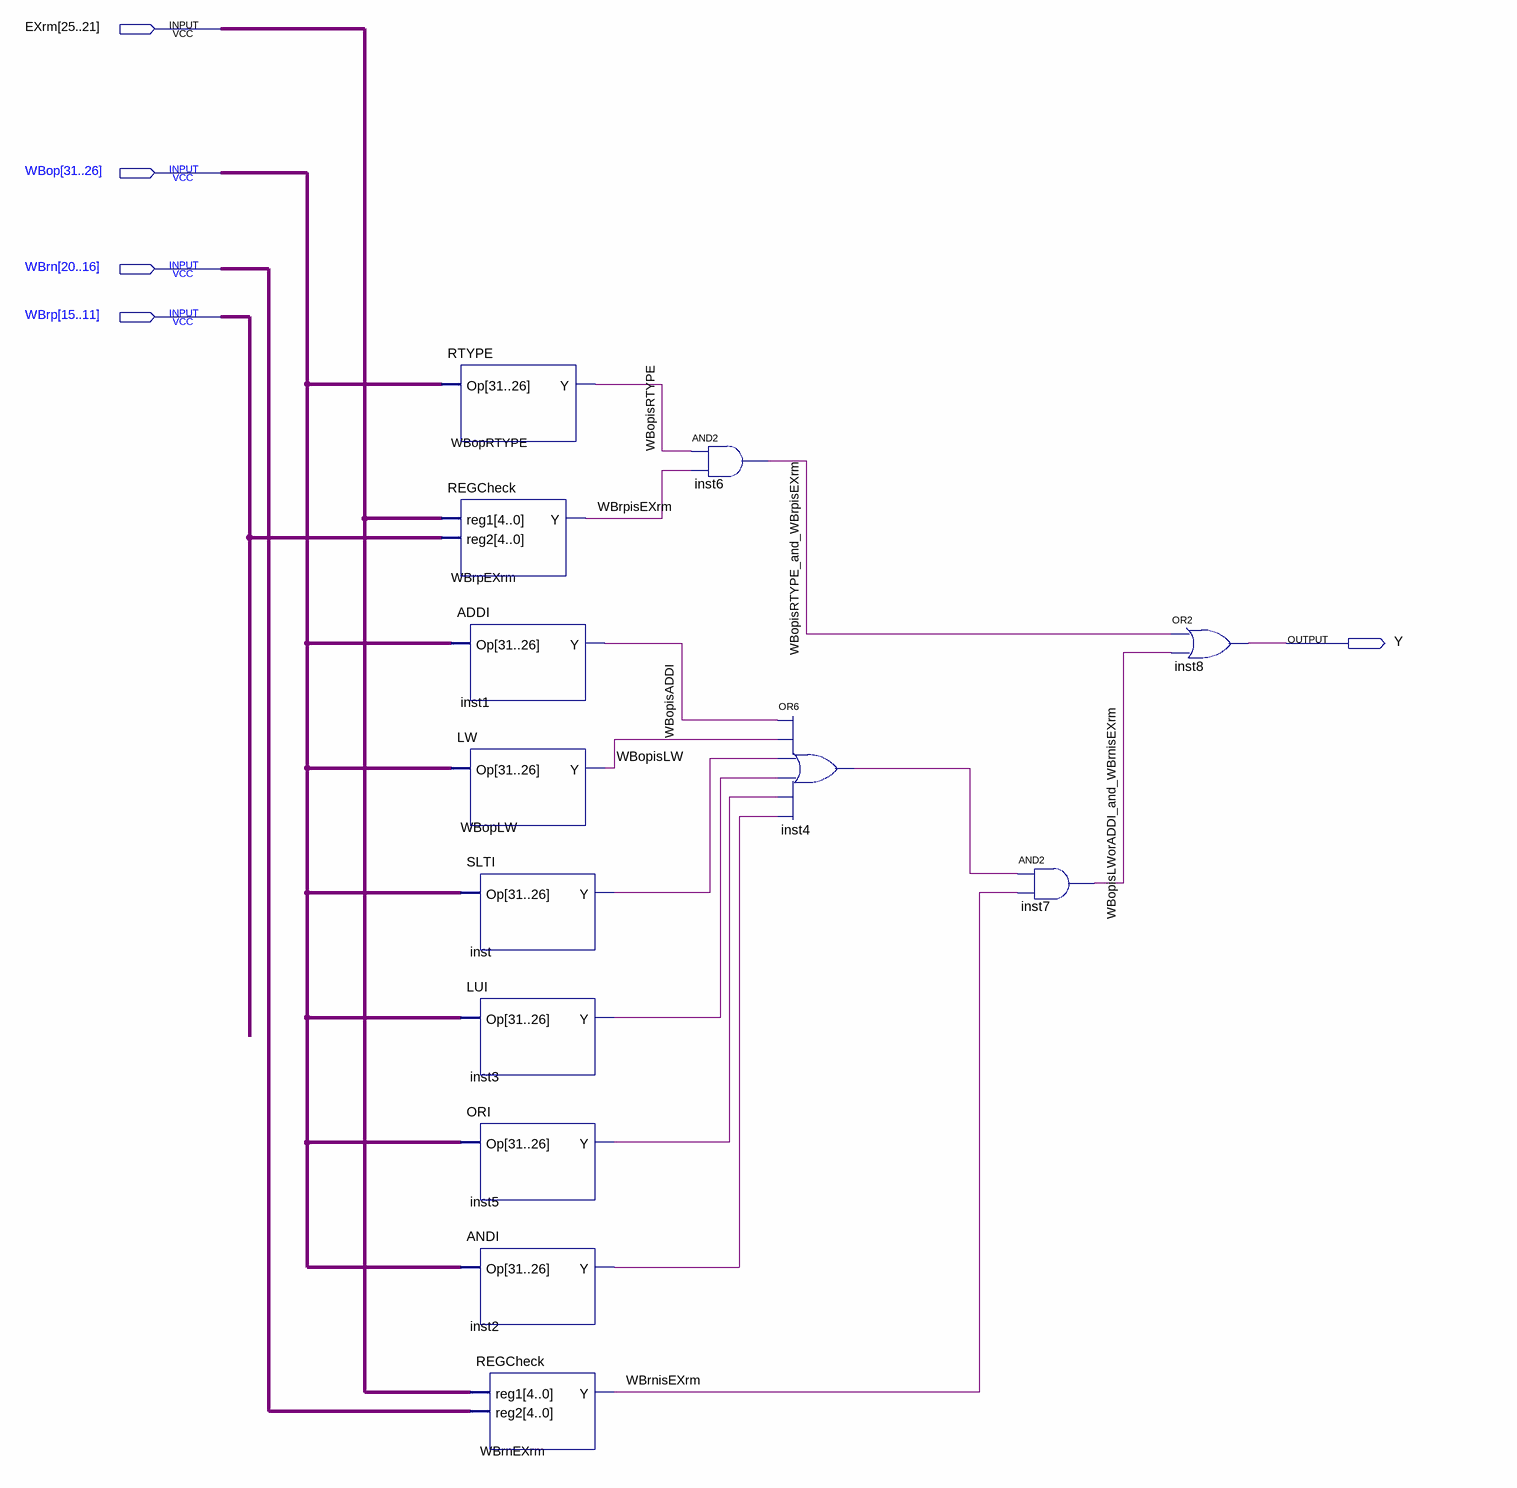
[diagram p0: schematic sheet]
// Quartus schematic ForwardAfromWBtoEX.bdf as structural Verilog: 13 symbols, 5 pins
module ForwardAfromWBtoEX (
  input  [25:21] EXrm,
  input  [31:26] WBop,
  input  [20:16] WBrn,
  input  [15:11] WBrp,
  output Y
);

  wire inst2_y, inst3_y, inst4_out, inst5_y, inst_y, WBopisADDI, WBopisLW, WBopisLWorADDI_and_WBrnisEXrm,
       WBopisRTYPE, WBopisRTYPE_and_WBrpisEXrm, WBrnisEXrm, WBrpisEXrm;

  RTYPE WBopRTYPE (.Op(WBop), .Y(WBopisRTYPE));
  REGCheck WBrpEXrm (.reg1(EXrm), .reg2(WBrp), .Y(WBrpisEXrm));
  ADDI inst1 (.Op(WBop), .Y(WBopisADDI));
  LW WBopLW (.Op(WBop), .Y(WBopisLW));
  SLTI inst (.Op(WBop), .Y(inst_y));
  LUI inst3 (.Op(WBop), .Y(inst3_y));
  ORI inst5 (.Op(WBop), .Y(inst5_y));
  ANDI inst2 (.Op(WBop), .Y(inst2_y));
  REGCheck WBrnEXrm (.reg1(EXrm), .reg2(WBrn), .Y(WBrnisEXrm));
  and inst6 (WBopisRTYPE_and_WBrpisEXrm, WBopisRTYPE, WBrpisEXrm);
  or inst4 (inst4_out, WBopisADDI, WBopisLW, inst_y, inst3_y, inst5_y, inst2_y);
  and inst7 (WBopisLWorADDI_and_WBrnisEXrm, inst4_out, WBrnisEXrm);
  or inst8 (Y, WBopisRTYPE_and_WBrpisEXrm, WBopisLWorADDI_and_WBrnisEXrm);
endmodule
